# EAGLE schematic detector ne602 (EAGLE 9.1.2)
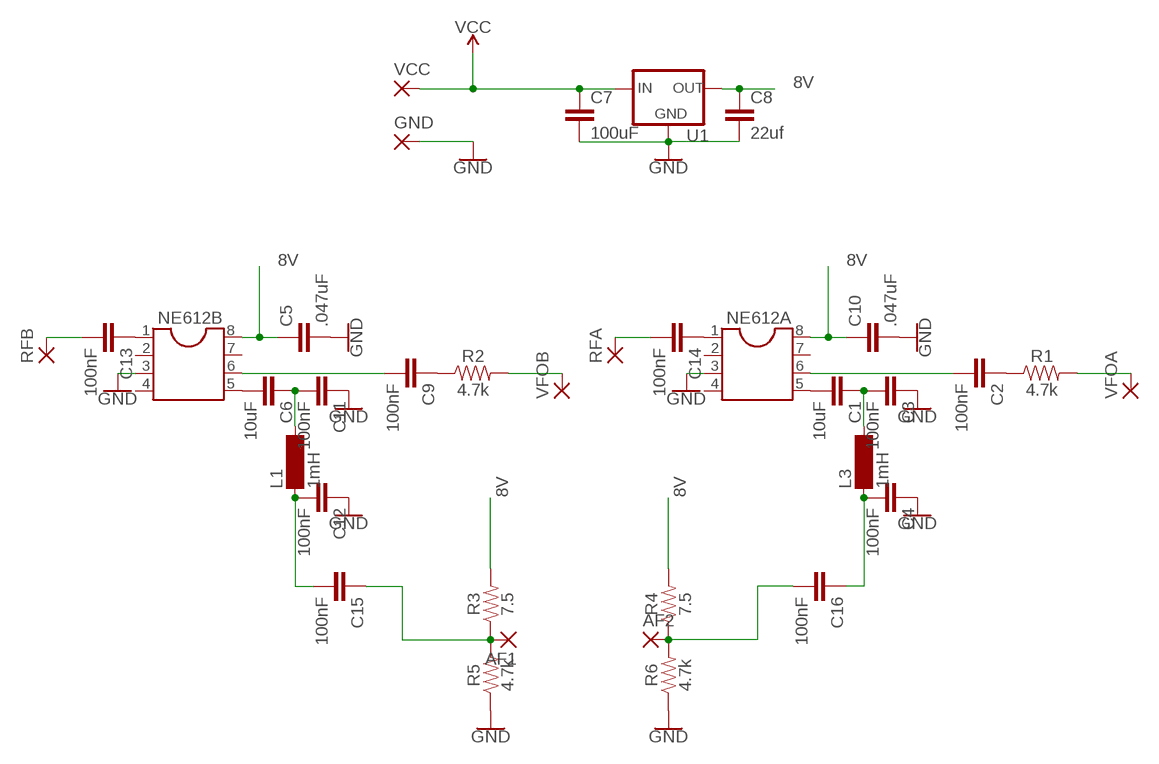
[diagram p0: schematic, sheet 1]

## Parts
AF1  3,17/1,1  [3,17/1,1]
AF2  3,17/1,1  [3,17/1,1]
C1  10uF  C5/3.5  [C5B3.5]
C2  100nF  C5/3.5  [C5B3.5]
C3  100nF  C5/3.5  [C5B3.5]
C4  100nF  C5/3.5  [C5B3.5]
C5  .047uF  C5/3.5  [C5B3.5]
C6  10uF  C5/3.5  [C5B3.5]
C7  100uF  C5/3.5  [C5B3.5]
C8  22uf  C5/3.5  [C5B3.5]
C9  100nF  C5/3.5  [C5B3.5]
C10  .047uF  C5/3.5  [C5B3.5]
C11  100nF  C5/3.5  [C5B3.5]
C12  100nF  C5/3.5  [C5B3.5]
C13  100nF  C5/3.5  [C5B3.5]
C14  100nF  C5/3.5  [C5B3.5]
C15  100nF  C5/3.5  [C5B3.5]
C16  100nF  C5/3.5  [C5B3.5]
GND  3,17/1,1  [3,17/1,1]
L1  1mH  BS75  [BS75]
L3  1mH  BS75  [BS75]
NE612A  DIL8  [DIL08]
NE612B  DIL8  [DIL08]
R1  4.7k  1KOHM-HORIZ-1/4W-1%  [AXIAL-0.3]
R2  4.7k  1KOHM-HORIZ-1/4W-1%  [AXIAL-0.3]
R3  7.5  1KOHM-HORIZ-1/4W-1%  [AXIAL-0.3]
R4  7.5  1KOHM-HORIZ-1/4W-1%  [AXIAL-0.3]
R5  4.7k  1KOHM-HORIZ-1/4W-1%  [AXIAL-0.3]
R6  4.7k  1KOHM-HORIZ-1/4W-1%  [AXIAL-0.3]
RFA  3,17/1,1  [3,17/1,1]
RFB  3,17/1,1  [3,17/1,1]
U1  V_REG_78XXTO-92_UNTESTED  [TO-92]
VCC  3,17/1,1  [3,17/1,1]
VFOA  3,17/1,1  [3,17/1,1]
VFOB  3,17/1,1  [3,17/1,1]

## Nets
8V: C5.1 C8.1 C10.1 NE612A.8 NE612B.8 R3.P$2 R4.P$2 U1.1(OUT)
GND: C3.1 C4.1 C5.2 C7.2 C8.2 C10.2 C11.1 C12.1 GND.1(P) NE612A.3 NE612B.3 R5.P$1 R6.P$1 U1.2(GND)
N$1: C1.2 NE612A.5
N$2: C2.2 NE612A.6
N$3: C1.1 C3.2 L3.2
N$4: C4.2 C16.1 L3.1
N$5: C2.1 R1.P$1
N$6: R1.P$2 VFOA.1(P)
N$7: C13.1 NE612B.1
N$8: C6.2 NE612B.5
N$9: C9.2 NE612B.6
N$10: C6.1 C11.2 L1.2
N$11: C12.2 C15.2 L1.1
N$12: C9.1 R2.P$1
N$13: R2.P$2 VFOB.1(P)
N$14: C14.1 NE612A.1
N$15: C13.2 RFB.1(P)
N$16: C14.2 RFA.1(P)
N$17: AF1.1(P) C15.1 R3.P$1 R5.P$2
N$18: AF2.1(P) C16.2 R4.P$1 R6.P$2
VCC: C7.1 U1.3(IN) VCC.1(P)
Unconnected: NE612A.2 NE612A.4 NE612A.7 NE612B.2 NE612B.4 NE612B.7

## Library data of the parts
AF1 AF2 GND RFA RFB VCC VFOA VFOB = wirepad:3,17/1,1: THROUGH-HOLE PAD
C1-C16 = capacitor-wima:C: CAPACITOR naming: grid - package width
L1 L3 = inductor-neosid:BS: INDUCTOR nominal inductance, magnetically screened; OC_FARNELL: unknown; OC_NEWARK: unknown
NE612A NE612B = ic-package:DIL8: Dual In Line / Socket
R1-R6 = SparkFun-Resistors:1KOHM: 1kΩ resistor A resistor is a passive two-terminal electrical component that implements electrical resistance as a circuit element. Resistors act to reduce current flow, and, at the same time, act to lower voltage levels within circuits. - Wikipedia; PROD_ID: RES-12182; VALUE: 1k
U1 = SparkFun-IC-Power:V_REG_78XX: Voltage Regulator Standard 78xx regulator. IGO (Input Ground Output). Spark Fun Electronics SKU : COM-00107

## Net classes
0 default: width 0.762 mm, drill 0.762 mm, clearance 0.508 mm